# EAGLE schematic Steering (EAGLE 9.3.1)
AUTHORS: Austin Keener, Peter Wilson, Johannes Kunz, Mukund Pandiri; REVISION: 1.1; SCH_DESC: Ethernet Breakout Board for Lidar Lite 3 Modules; TEAM: RoboRacing; TITLE: Lidar_Breakout
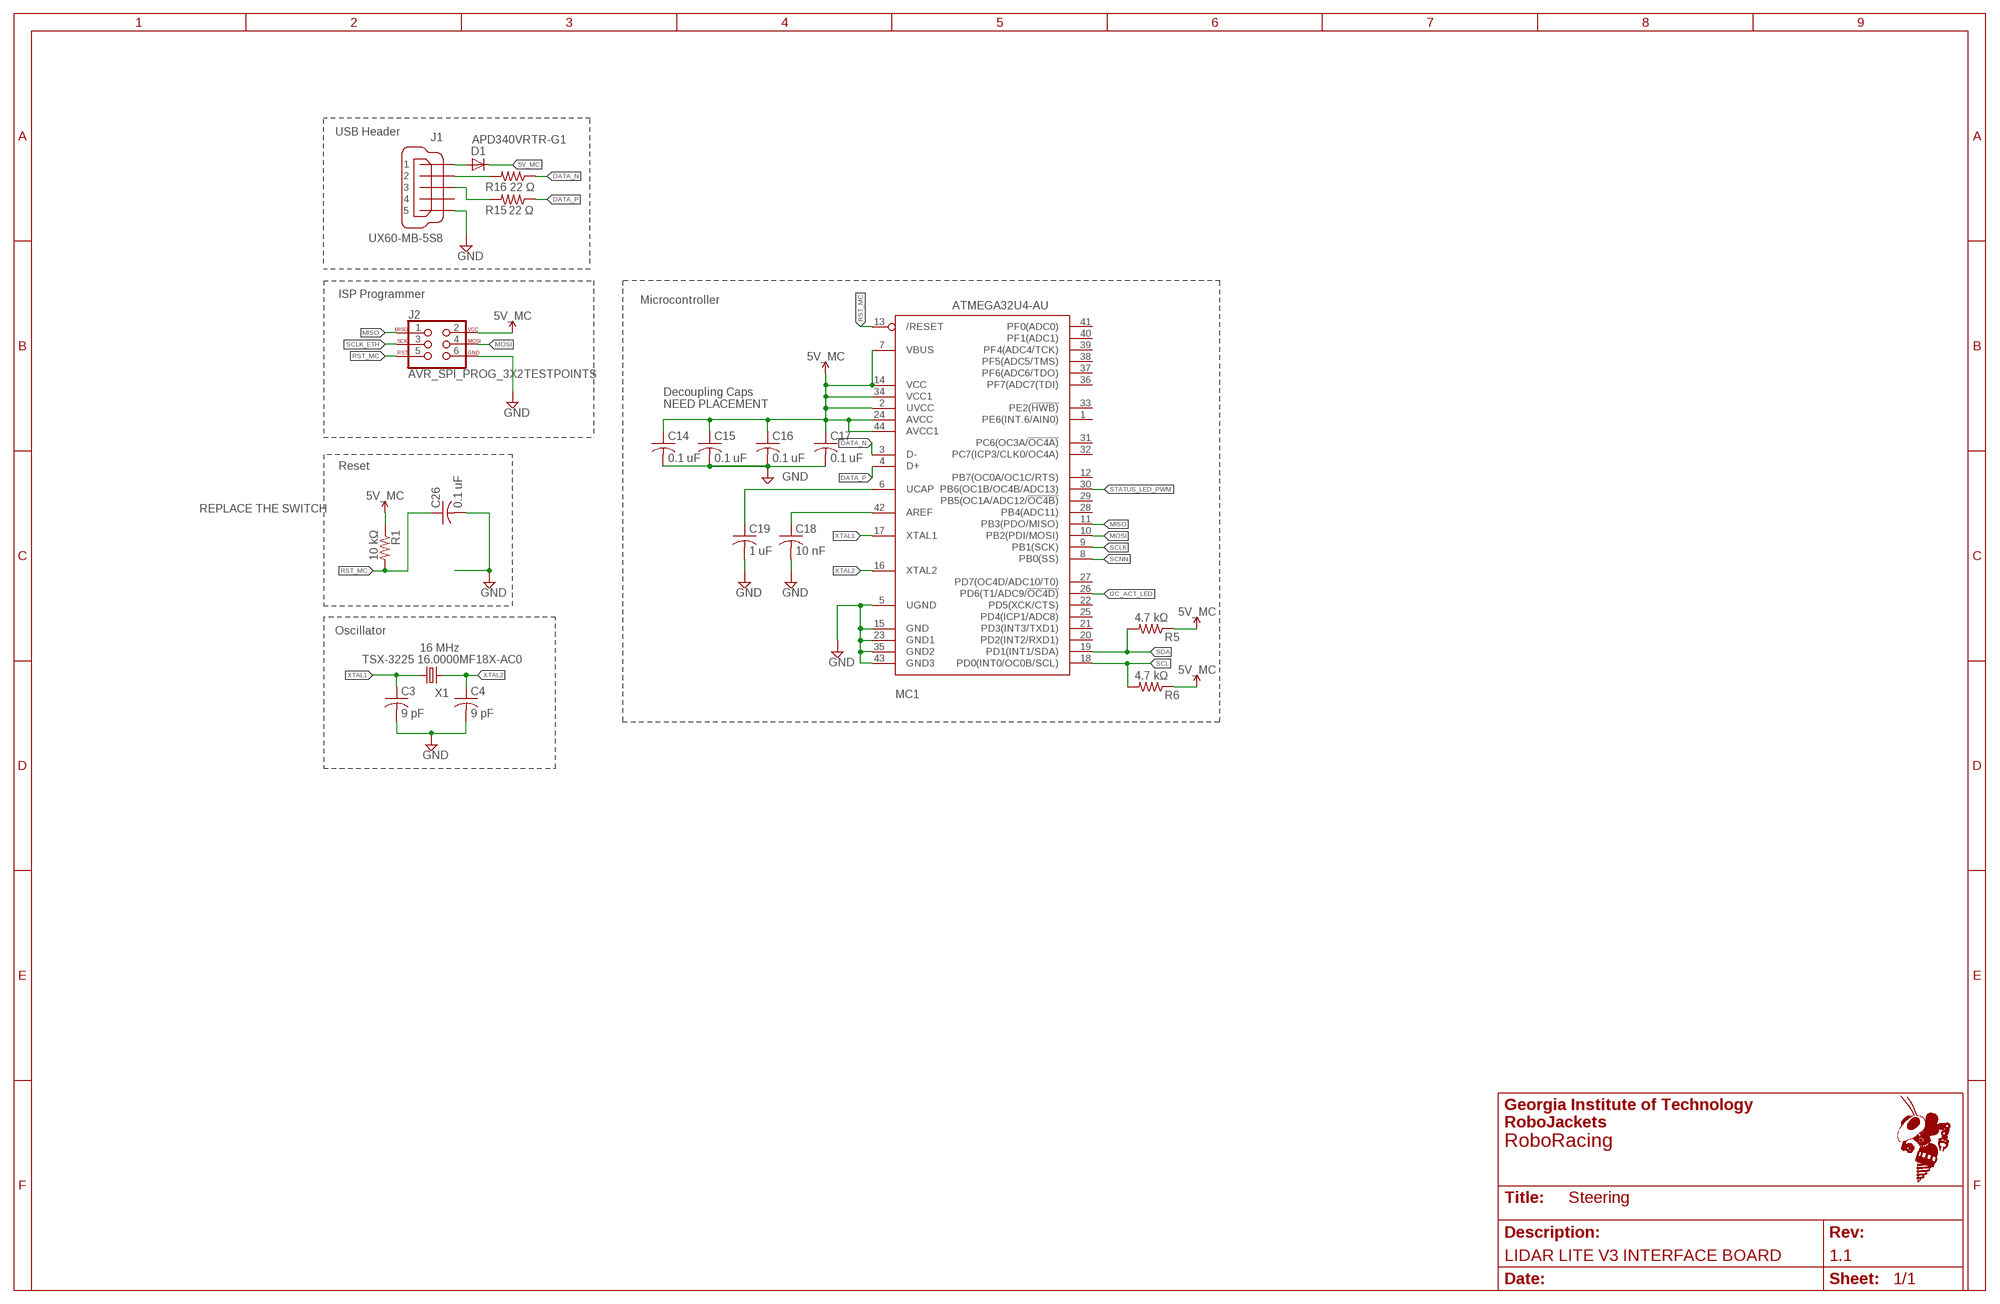
[diagram p0: schematic, sheet 1]
FRAME1 (FRAME_B_L): SCH_DESC: LIDAR LITE V3 INTERFACE BOARD

## Parts
C3  9 pF  C-USC0603  [C0603]
C4  9 pF  C-USC0603  [C0603]
C14  0.1 uF  C-USC0603  [C0603]
C15  0.1 uF  C-USC0603  [C0603]
C16  0.1 uF  C-USC0603  [C0603]
C17  0.1 uF  C-USC0603  [C0603]
C18  10 nF  C-USC0603  [C0603]
C19  1 uF  C-USC0603  [C0603]
C26  0.1 uF  C-USC0603  [C0603]
D1  APD340VRTR-G1  DIODE-DO-214AC  [DO-214AC]
J1  UX60-MB-5S8  [UX60-MB-5S8]
J2  AVR_SPI_PROG_3X2TESTPOINTS  [2X3_TEST_POINTS]
MC1  ATMEGA32U4-AU  [TQFP44]
R1  10 kΩ  R-US_R0603  [R0603]
R5  4.7 kΩ  R-US_R0603  [R0603]
R6  4.7 kΩ  R-US_R0603  [R0603]
R15  22 Ω  R-US_R0603  [R0603]
R16  22 Ω  R-US_R0603  [R0603]
X1  TSX-3225 16.0000MF18X-AC0  XTAL-3.2X2.5  [XTAL-3.2X2.5]

## Nets
5V_MC: C14.1 C15.1 C16.1 C17.1 D1.C J2.2 MC1.2(UVCC) MC1.7(VBUS) MC1.14(VCC) MC1.24(AVCC) MC1.34(VCC1) MC1.44(AVCC1) R1.1 R5.1 R6.1
AREF: C18.1 MC1.42(AREF)
DATA_N [diff]: MC1.3(D-) R16.1
DATA_P [diff]: MC1.4(D+) R15.1
GND: C3.2 C4.2 C14.2 C15.2 C16.2 C17.2 C18.2 C19.2 C26.2 J1.5 J2.6 MC1.5(UGND) MC1.15(GND) MC1.23(GND1) MC1.35(GND2) MC1.43(GND3)
I2C_ACT_LED: MC1.26(PD6(T1/ADC9/!OC4D))
MISO: J2.1 MC1.11(PB3(PDO/MISO))
MOSI: J2.4 MC1.10(PB2(PDI/MOSI))
N$1: D1.A J1.1
N$8: J1.2 R16.2
N$23: J1.3 R15.2
RST_MC: C26.1 J2.5 MC1.13(/RESET) R1.2
SCL: MC1.18(PD0(INT0/OC0B/SCL)) R6.2
SCLK: MC1.9(PB1(SCK))
SCLK_ETH: J2.3
SCNN: MC1.8(PB0(SS))
SDA: MC1.19(PD1(INT1/SDA)) R5.2
STATUS_LED_PWM: MC1.30(PB6(OC1B/OC4B/ADC13))
UCAP: C19.1 MC1.6(UCAP)
XTAL1: C3.1 MC1.17(XTAL1) X1.1
XTAL2: C4.1 MC1.16(XTAL2) X1.3
Unconnected: J1.4 MC1.1(PE6(INT.6/AIN0)) MC1.12(PB7(OC0A/OC1C/RTS)) MC1.20(PD2(INT2/RXD1)) MC1.21(PD3(INT3/TXD1)) MC1.22(PD5(XCK/CTS)) MC1.25(PD4(ICP1/ADC8)) MC1.27(PD7(OC4D/ADC10/T0)) MC1.28(PB4(ADC11)) MC1.29(PB5(OC1A/ADC12/!OC4B)) MC1.31(PC6(OC3A/!OC4A)) MC1.32(PC7(ICP3/CLK0/OC4A)) MC1.33(PE2(!HWB)) MC1.36(PF7(ADC7(TDI)) MC1.37(PF6(ADC6/TDO)) MC1.38(PF5(ADC5/TMS)) MC1.39(PF4(ADC4/TCK)) MC1.40(PF1(ADC1)) MC1.41(PF0(ADC0))

## Notes on the sheet
- USB Header
- ISP Programmer
- Microcontroller
- Decoupling Caps
  NEED PLACEMENT
- Reset
- REPLACE THE SWITCH
- Oscillator
- 16 MHz

## Library data of the parts
C3 C4 C14-C19 C26 = resistor:C-US: CAPACITOR, American symbol
D1 = RoboJackets-Diodes:DIODE-: DIODE
J1 = RoboJackets-Connectors:UX60*-MB-5S?: Mini USB Connector Brand: Hirose Electric Co Ltd <http://www.hirose.com/us/> Series: UX <http://www.digikey.com/product-search/en?FV=fff40016,fff802e4,ffec3225> Distributor: Digi-Key <http://www.digikey.com/product-detail/en/UX60A-MB-5ST/H2961CT-ND/597540>; PINS: 5
J2 = SparkFun-Connectors:AVR_SPI_PROG_3X2: AVR ISP 6 Pin This is the reduced ISP connector for AVR programming. Common on Arduino. This footprint will take up less PCB space and can be used with a 10-pin to 6-pin adapter such as SKU: BOB-08508 **Special note about "TEST_POINT" package. The stop mask is on the top side, so if you want your programming test points to be on the bottom of your board, make sure to place this package on the bottom side of the board. This also ensure that the orientation to program from the bottom side will be correct. SparkFun Products: SparkFun ISP Pogo Adapter <https://www.sparkfun.com/products/11591> - NS Tiny AVR Programmer <https://www.sparkfun.com/products/11801> -PTH
MC1 = adafruit:ATMEGA32U4: http://www.ladyada.net/library/eagle
R1 R5 R6 R15 R16 = rcl:R-US_: RESISTOR, American symbol; SPICEPREFIX: R
X1 = RoboJackets-FreqGen:XTAL

## Net classes
0 default: width 0.203 mm
2 diff: width 0.406 mm